# EAGLE design main (EAGLE 5.02)
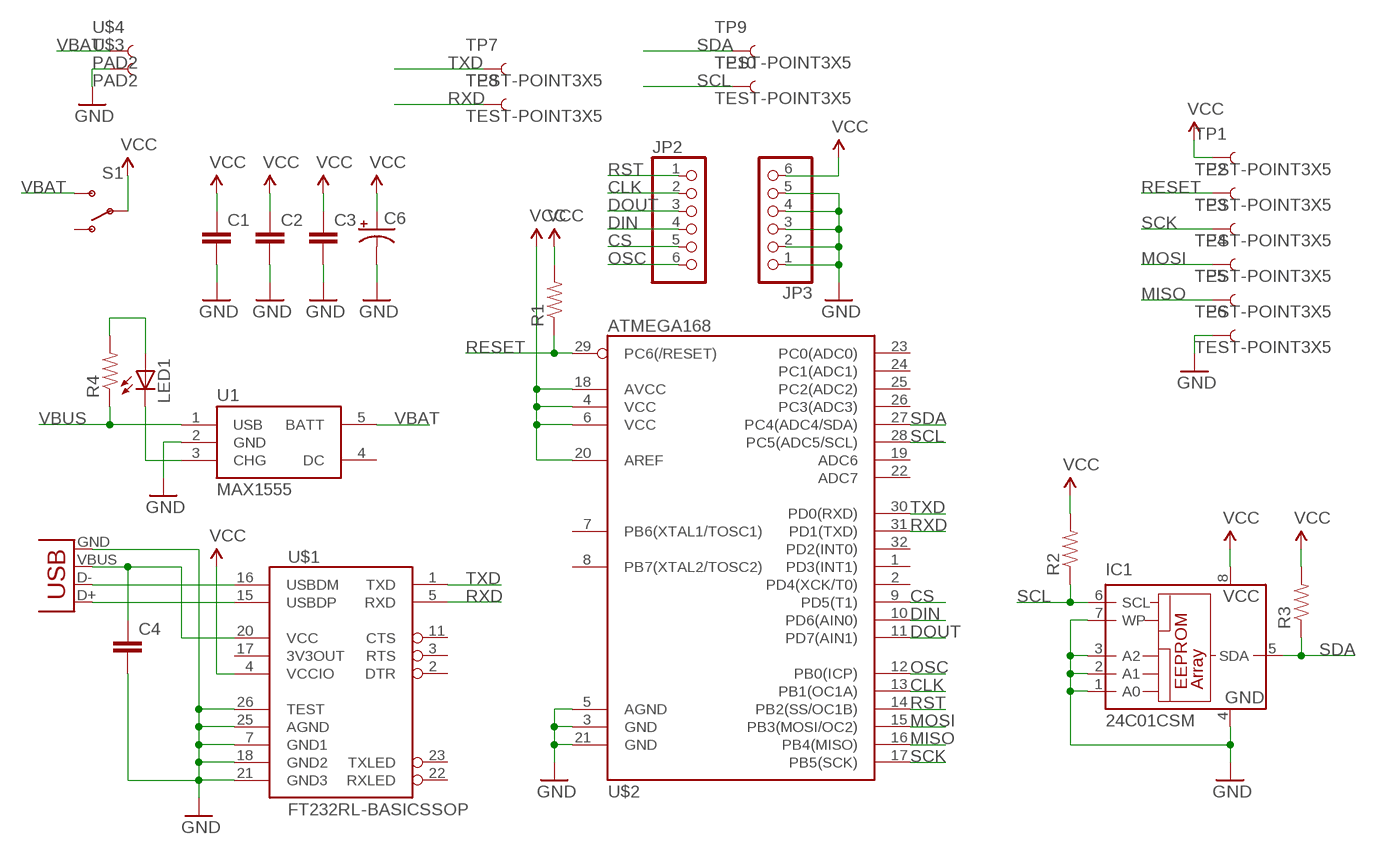
[diagram p0: schematic, sheet 1]

## Parts
C1  CAP0603  [0603]
C2  CAP0603  [0603]
C3  CAP0603  [0603]
C4  CAP0603  [0603]
C6  CAP_POL3528  [EIA3528]
IC1  24C01CSM  [SO-08M]
JP2  PINHD-1X6  [1X06]
JP3  PINHD-1X6  [1X06]
LED1  LED0603  [LED-0603]
R1  RESISTOR0603  [0603]
R2  RESISTOR0603  [0603]
R3  RESISTOR0603  [0603]
R4  RESISTOR0603  [0603]
S1  SWITCH-SPSTSMD2  [SWITCH-SPDT-SMD]
TP1  TEST-POINT3X5  [PAD.03X.05]
TP2  TEST-POINT3X5  [PAD.03X.05]
TP3  TEST-POINT3X5  [PAD.03X.05]
TP4  TEST-POINT3X5  [PAD.03X.05]
TP5  TEST-POINT3X5  [PAD.03X.05]
TP6  TEST-POINT3X5  [PAD.03X.05]
TP7  TEST-POINT3X5  [PAD.03X.05]
TP8  TEST-POINT3X5  [PAD.03X.05]
TP9  TEST-POINT3X5  [PAD.03X.05]
TP10  TEST-POINT3X5  [PAD.03X.05]
U1  MAX1555  [SOT23-5]
U$1  FT232RL-BASICSSOP  [SSOP28DB]
U$2  ATMEGA168  [TQFP32-08]
U$3  PAD2  [PAD-3MMX3MM]
U$4  PAD2  [PAD-3MMX3MM]
X1  USBSMD  [USB-MINIB]

## Nets
CLK: JP2.2 U$2.13(PB1(OC1A))
CS: JP2.5 U$2.9(PD5(T1))
DIN: JP2.4 U$2.10(PD6(AIN0))
DOUT: JP2.3 U$2.11(PD7(AIN1))
GND: C1.2 C2.2 C3.2 C4.2 C6.C(-) IC1.1(A0) IC1.2(A1) IC1.3(A2) IC1.4(GND) IC1.7(WP) JP3.1 JP3.2 JP3.3 JP3.4 JP3.5 TP6.P$1 U1.2(GND) U$1.7(GND1) U$1.18(GND2) U$1.21(GND3) U$1.25(AGND) U$1.26(TEST) U$2.3(GND) U$2.5(AGND) U$2.21(GND) U$3.P$1 X1.GND
MISO: TP5.P$1 U$2.16(PB4(MISO))
MOSI: TP4.P$1 U$2.15(PB3(MOSI/OC2))
N$1: U$1.15(USBDP) X1.D+
N$2: U$1.16(USBDM) X1.D-
N$3: LED1.C U1.3(CHG)
N$4: LED1.A R4.2
OSC: JP2.6 U$2.12(PB0(ICP))
RESET: R1.1 TP2.P$1 U$2.29(PC6(/RESET))
RST: JP2.1 U$2.14(PB2(SS/OC1B))
RXD: TP8.P$1 U$1.5(RXD) U$2.31(PD1(TXD))
SCK: TP3.P$1 U$2.17(PB5(SCK))
SCL: IC1.6(SCL) R2.1 TP10.P$1 U$2.28(PC5(ADC5/SCL))
SDA: IC1.5(SDA) R3.1 TP9.P$1 U$2.27(PC4(ADC4/SDA))
TXD: TP7.P$1 U$1.1(TXD) U$2.30(PD0(RXD))
VBAT: S1.3(S) U1.5(BATT) U$4.P$1
VBUS: C4.1 R4.1 U1.1(USB) U$1.20(VCC) X1.VBUS
VCC: C1.1 C2.1 C3.1 C6.A(+) IC1.8(VCC) JP3.6 R1.2 R2.2 R3.2 S1.2(P) TP1.P$1 U$1.4(VCCIO) U$2.4(VCC) U$2.6(VCC) U$2.18(AVCC) U$2.20(AREF)
Unconnected: S1.1(O) U1.4(DC) U$1.2(DTR) U$1.3(RTS) U$1.11(CTS) U$1.17(3V3OUT) U$1.22(RXLED) U$1.23(TXLED) U$2.1(PD3(INT1)) U$2.2(PD4(XCK/T0)) U$2.7(PB6(XTAL1/TOSC1)) U$2.8(PB7(XTAL2/TOSC2)) U$2.19(ADC6) U$2.22(ADC7) U$2.23(PC0(ADC0)) U$2.24(PC1(ADC1)) U$2.25(PC2(ADC2)) U$2.26(PC3(ADC3)) U$2.32(PD2(INT0))

## Library data of the parts
C1-C4 = SparkFun:CAP: Capacitor Standard 0603 ceramic capacitor, and 0.1" leaded capacitor.
C6 = SparkFun:CAP_POL: Capacitor Polarized These are standard SMD and PTH capacitors. Normally 10uF, 47uF, and 100uF in electrolytic and tantalum varieties. Always verify the external diameter of the through hole cap, it varies with capacity, voltage, and manufacturer. The EIA devices should be standard.
IC1 = microchip:24C*: Serial EEPROM 1 K/2 K/4 K
JP2 JP3 = pinhead:PINHD-1X6: PIN HEADER
LED1 = SparkFun:LED: LEDs Standard schematic elements and footprints for 5mm, 3mm, 1206, and 0603 sized LEDs. 5mm - Spark Fun Electronics SKU : COM-00529 (and others)
R1-R4 = SparkFun:RESISTOR: Resistor Basic schematic elements and footprints for 0603, 1206, and PTH 1/10th watt (small) resistors.
S1 = SparkFun:SWITCH-SPST: SPST Switch Simple slide switch. Spark Fun Electronics SKU : COM-00102
TP1-TP10 = SparkFun:TEST-POINT
U1 = SparkFun:MAX1555: MAX1555 Lithium Charger IC SOT-23 Lithium Polymer charging IC. Schematic element and footprint proven. Spark Fun Electronics SKU : COM-00674
U$1 = SparkFun:FT232RL-BASIC: USB UART This is the simplified version of the FT232RL unit. Only what you need, nothing you don't. Spark Fun Electronics SKU : COM-00650
U$2 = SparkFun:ATMEGA168
U$3 U$4 = john:PAD2
X1 = SparkFun:USB: USB Connectors USB-B-PTH is fully proven SKU : PRT-00139 USB-miniB is fully proven SKU : PRT-00587 USB-A-PCB is untested. USB-A-H is throughly reviewed, but untested. Spark Fun Electronics SKU : PRT-00437 USB-B-SMT is throughly reviewed, but untested. Needs silkscreen touching up. USB-A-S has not been used/tested USB-MB-H has not been used/tested

## Board
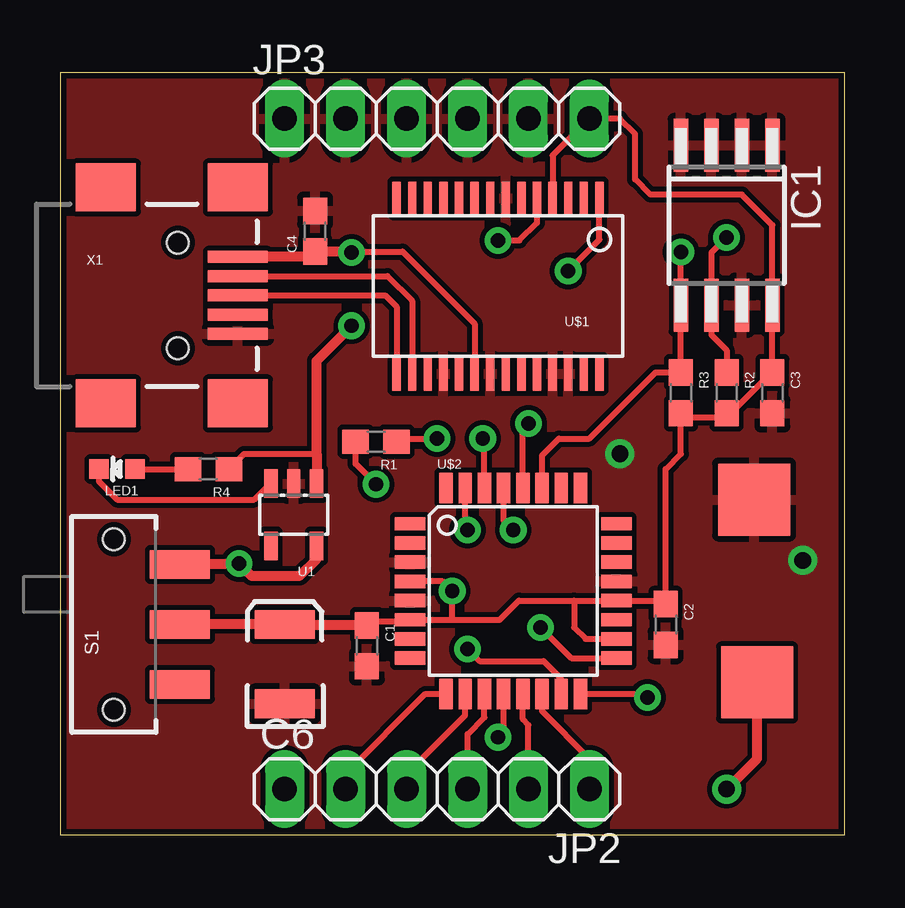
[diagram p1: board, top side]
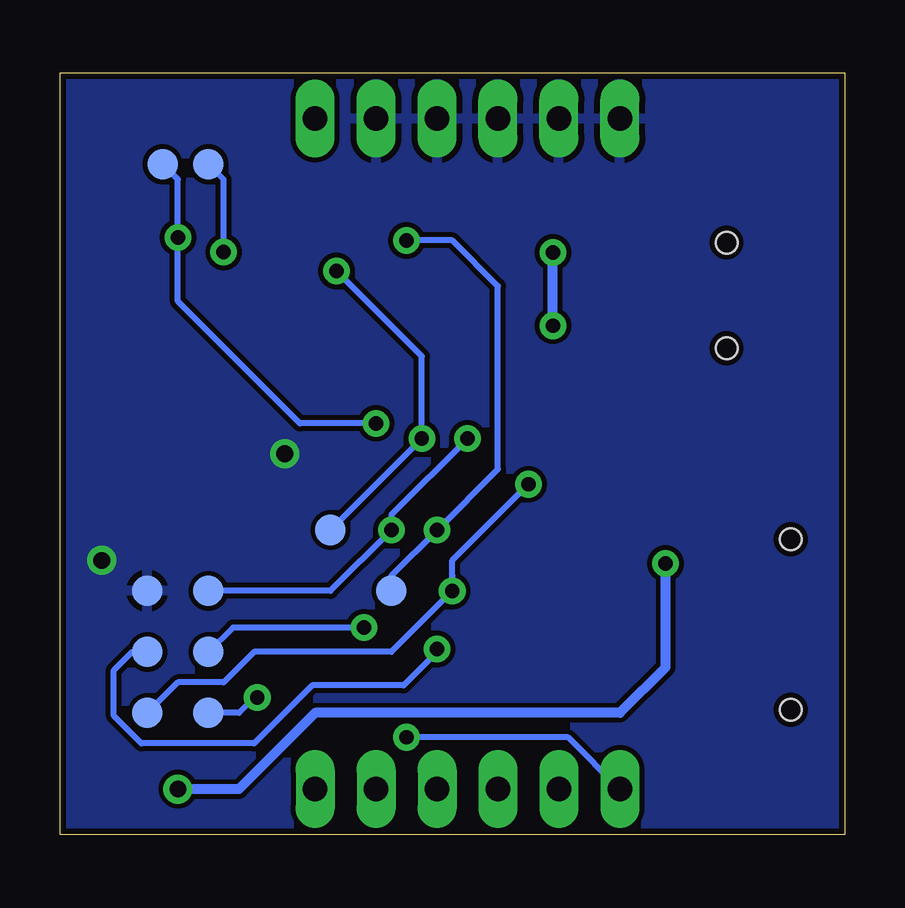
[diagram p2: board, bottom side, seen from below]

Size 32.69 x 31.74 mm. Coordinates in mm from the lower left corner, seen from the top.
Outline: 0,0 32.69,0 32.69,31.74 0,31.74 0,0
Copper layers (1*16): Top 0.035mm / dielectric 1.5mm / Bottom 0.035mm
Design rules "SparkFun": minimum track width 8mil, minimum drill 20mil, track to track 8mil, track to pad 8mil, pad to pad 8mil, via to via 8mil, smd to smd 8mil, copper to edge 10mil, drill to drill 8mil, minimum pad ring 12mil, minimum via ring 10mil, stop-mask expansion 4mil, vias tented up to drill 25mil, thermal gap 10mil

### Footprints (pad centres in the part's own frame; a part is rotated, then mirrored left to right if it is on the bottom)
0603 = smd 1.1 x 1: 1 -0.85,0; 2 0.85,0
EIA3528 = smd 1.2 x 2.5: A 1.65,0; C -1.65,0
SO-08M = smd 0.6 x 2.2: 1 -1.905,-3.33; 2 -0.635,-3.33; 3 0.635,-3.33; 4 1.905,-3.33; 5 1.905,3.33; 6 0.635,3.33; 7 -0.635,3.33; 8 -1.905,3.33
1X06 = drill 1.016 long: 1 -6.35,0; 2 -3.81,0; 3 -1.27,0; 4 1.27,0; 5 3.81,0; 6 6.35,0
LED-0603 = smd 0.8 x 0.8: A 0,-0.75; C 0,0.75
SWITCH-SPDT-SMD = smd 1.2 x 2.5: 1 -2.5,-2.75; 2 0,-2.75; 3 2.5,-2.75 | hole 0.9: -3.55,0; 3.55,0
PAD.03X.05 = smd 1.27 x 1.27: P$1 0,0
SOT23-5 = smd 0.55 x 1.2: 1 -0.95,-1.3; 2 0,-1.3; 3 0.95,-1.3; 4 0.95,1.3; 5 -0.95,1.3
SSOP28DB = smd 0.348 x 1.397: 1 -4.225,-3.656; 2 -3.575,-3.656; 3 -2.925,-3.656; 4 -2.275,-3.656; 5 -1.625,-3.656; 6 -0.975,-3.656; 7 -0.325,-3.656; 8 0.325,-3.656; 9 0.975,-3.656; 10 1.625,-3.656; 11 2.275,-3.656; 12 2.925,-3.656; 13 3.575,-3.656; 14 4.225,-3.656; 15 4.225,3.656; 16 3.575,3.656; 17 2.925,3.656; 18 2.275,3.656; 19 1.625,3.656; 20 0.975,3.656; 21 0.325,3.656; 22 -0.325,3.656; 23 -0.975,3.656; 24 -1.625,3.656; 25 -2.275,3.656; 26 -2.925,3.656; 27 -3.575,3.656; 28 -4.225,3.656
TQFP32-08 = smd 1.27 x 0.559: 1 -4.293,2.8; 2 -4.293,2; 3 -4.293,1.2; 4 -4.293,0.4; 5 -4.293,-0.4; 6 -4.293,-1.2; 7 -4.293,-2; 8 -4.293,-2.8; 17 4.293,-2.8; 18 4.293,-2; 19 4.293,-1.2; 20 4.293,-0.4; 21 4.293,0.4; 22 4.293,1.2; 23 4.293,2; 24 4.293,2.8 | smd 0.559 x 1.27: 9 -2.8,-4.293; 10 -2,-4.293; 11 -1.2,-4.293; 12 -0.4,-4.293; 13 0.4,-4.293; 14 1.2,-4.293; 15 2,-4.293; 16 2.8,-4.293; 25 2.8,4.293; 26 2,4.293; 27 1.2,4.293; 28 0.4,4.293; 29 -0.4,4.293; 30 -1.2,4.293; 31 -2,4.293; 32 -2.8,4.293
PAD-3MMX3MM = smd 3 x 3: P$1 0,0
USB-MINIB = smd 2.5 x 0.5: D+ 2.5,0; D- 2.5,0.8; GND 2.5,-1.6; ID 2.5,-0.8; VBUS 2.5,1.6 | smd 2.5 x 2: GND@1 -3,-4.5; GND@2 -3,4.5; GND@3 2.5,4.5; GND@4 2.5,-4.5 | hole 0.9: 0,2.2; 0,-2.2

### Placement (x,y rotation side)
C1  12.79,7.87 270 top
C2  25.23,8.76 270 top
C3  29.68,18.41 270 top
C4  10.63,25.14 90 top
C6  9.36,7.11 90 top
IC1  27.77,25.39 180 top
JP2  15.71,1.9 180 top
JP3  15.71,29.84 0 top
LED1  2.38,15.23 90 top
R1  13.17,16.38 180 top
R2  27.77,18.41 270 top
R3  25.87,18.41 270 top
R4  6.19,15.23 180 top
S1  2.25,8.76 90 top
TP1  29.05,5.08 0 bottom
TP2  26.51,10.16 0 bottom
TP3  26.51,7.61 0 bottom
TP4  29.05,7.61 0 bottom
TP5  26.51,5.08 0 bottom
TP6  29.05,10.16 0 bottom
TP7  21.43,12.7 0 bottom
TP8  18.89,10.16 0 bottom
TP9  26.51,27.94 0 bottom
TP10  28.41,27.94 0 bottom
U1  9.74,13.33 180 top
U$1  18.25,22.86 180 top
U$2  18.89,10.16 0 top
U$3  28.92,13.96 0 top
U$4  29.05,6.34 0 top
X1  4.92,22.47 0 top

### Tracks (layer width: path | path; a pad name or v marks a point on that pad's centre or on a via)
CLK
  Top 0.254: U$2.13 19.29,4.8 19.52,4.57 JP2.2
CS
  Top 0.254: U$2.9 15.23,5.86 11.9,2.54 JP2.5
DIN
  Top 0.254: U$2.10 16.89,4.98 14.44,2.54 JP2.4
DOUT
  Top 0.254: U$2.11 17.68,4.89 16.98,4.19 JP2.3
GND  (via drill 0.7)
  other vias: 23.33,15.87 30.95,11.43
  pour Bottom: -0.16,31.74 32.85,31.74 32.85,0 -0.16,0
  pour Top: -0.16,31.74 32.85,31.74 32.85,0 -0.16,0
MISO  (via drill 0.6)
  Top 0.254: U$2.16 24.32,5.86 v24.47,5.71
  Bottom 0.254: v24.47,5.71 24.6,5.71 25.23,5.08 TP5.P$1
MOSI  (via drill 0.6)
  Top 0.254: U$2.15 20.89,6.5 20.16,7.23 17.49,7.23 v16.98,7.74
  Bottom 0.254: v16.98,7.74 16.85,7.74 18.38,6.22 22.19,6.22 24.6,3.81 29.3,3.81 30.44,4.95 30.44,6.85 29.68,7.61 TP4.P$1 28.92,7.61
N$1
  Top 0.254: U$1.15 14.02,22 13.55,22.47 X1.D+
N$2
  Top 0.254: X1.D- 13.64,23.27 14.68,22.24 U$1.16
N$3
  Top 0.254: LED1.C 1.62,14.71 2.38,13.96 8.09,13.96 8.75,14.63
  Top 0.406: 8.75,14.63 U1.3
N$4
  Top 0.254: LED1.A R4.2
  Top 0.406: LED1.A 3.01,15.23
OSC  (via drill 0.6)
  Top 0.254: U$2.12 18.48,4.33 v18.25,4.06
  Bottom 0.254: v18.25,4.06 11.52,4.06 JP2.6
RESET  (via drill 0.6)
  Top 0.254: U$2.29 18.48,13.09 v18.89,12.7 | R1.1 13.93,16.38 13.8,16.5 v15.71,16.5
  Bottom 0.254: v15.71,16.5 18.89,13.33 v18.89,12.7 21.43,10.16 TP2.P$1
RST
  Top 0.254: U$2.14 20.09,5.15 22.06,3.17 JP2.1
RXD  (via drill 0.6)
  Top 0.254: U$1.5 19.88,25.5 19.14,24.76 v18.25,24.76 | U$2.31 16.89,12.79 v16.98,12.7
  Bottom 0.254: v18.25,24.76 16.34,24.76 14.44,22.86 14.44,15.23 v16.98,12.7 18.89,10.79 TP8.P$1
SCK  (via drill 0.6)
  Top 0.254: U$2.17 21.3,7.35 v20.03,8.63
  Bottom 0.254: v20.03,8.63 25.49,8.63 TP3.P$1
SCL  (via drill 0.6)
  Top 0.254: R2.1 27.77,20.19 27.14,20.82 IC1.6 27.14,24.25 v27.77,24.89 | U$2.28 19.29,16.9 v19.52,17.14
  Bottom 0.254: v19.52,17.14 22.7,17.14 27.77,22.22 v27.77,24.89 27.77,27.3 TP10.P$1
SDA  (via drill 0.6)
  Top 0.254: U$2.27 20.09,15.8 20.79,16.5 22.06,16.5 24.81,19.26 R3.1 IC1.5 v25.87,24.28
  Bottom 0.254: v25.87,24.28 25.87,27.3 TP9.P$1
TXD  (via drill 0.6, 0.61)
  Top 0.254: U$2.30 17.68,16.43 v17.62,16.5 | U$1.1 22.48,24.79 v21.17,23.49
  Bottom 0.254: v21.17,23.49 17.62,19.93 v17.62,16.5 TP7.P$1
VBAT  (via drill 0.6, 0.7)
  Top 0.406: S1.3 7.29,11.26 7.46,11.43 v7.46,11.3 7.96,10.79 10,10.79 10.69,11.49 U1.5 | U$4.P$1 29.05,3.17 v27.77,1.9
  Bottom 0.406: v27.77,1.9 25.23,1.9 22.06,5.08 9.36,5.08 7.46,6.98 v7.46,11.3
VBUS  (via drill 0.6)
  Top 0.254: C4.1 10.63,24.25 10.45,24.07 | U$1.20 17.27,21.29 14.27,24.29 11.94,24.29 arc90 v12.15,24.25 11.86,24.29 | R4.1 7.67,15.87 10.69,15.87
  Top 0.406: 10.45,24.07 X1.VBUS | U1.1 10.69,15.87 10.69,19.74 v12.15,21.2 | 11.86,24.29 C4.1
  Bottom 0.406: v12.15,21.2 v12.15,24.25
VCC  (via drill 0.6)
  Top 0.254: 27.77,17.39 R2.2 | 27.77,17.39 29.55,19.17 29.68,19.17 C3.1 IC1.8 29.68,25.39 28.41,26.66 24.6,26.66 23.97,27.3 23.97,29.2 23.33,29.84 JP3.6 20.52,28.3 U$1.4 | R3.2 25.87,17.52 26,17.39 27.77,17.39 | 16.34,8.95 18.32,8.95 19.12,9.75 21.43,9.75 | 21.43,9.75 U$2.20 25,9.75 25.23,9.52 C2.1 25.23,15.23 25.87,15.87 R3.2 | 16.34,8.95 U$2.6 14.52,8.89 12.79,8.89 C1.1 | 16.34,8.95 v16.34,10.16 15.95,10.55 U$2.4 | U$2.18 21.9,8.16 21.43,8.63 21.43,9.75 | R1.2 12.32,15.45 v13.17,14.6 | R3.2 25.87,17.77
  Top 0.406: C1.1 12.79,8.76 C6.A 9.87,8.63 8.6,8.63 8.77,8.8 5,8.8 | 5,8.8 4.92,8.89 | S1.2 5,8.8
  Bottom 0.254: v13.17,14.6 16.34,11.43 16.34,10.79 | TP1.P$1 27.77,6.34 25.87,6.34 24.6,7.61 18.89,7.61 v16.34,10.16 16.34,10.79 | 16.34,10.79 16.34,10.54